# EAGLE design tempmonitor (EAGLE 7.6.0)
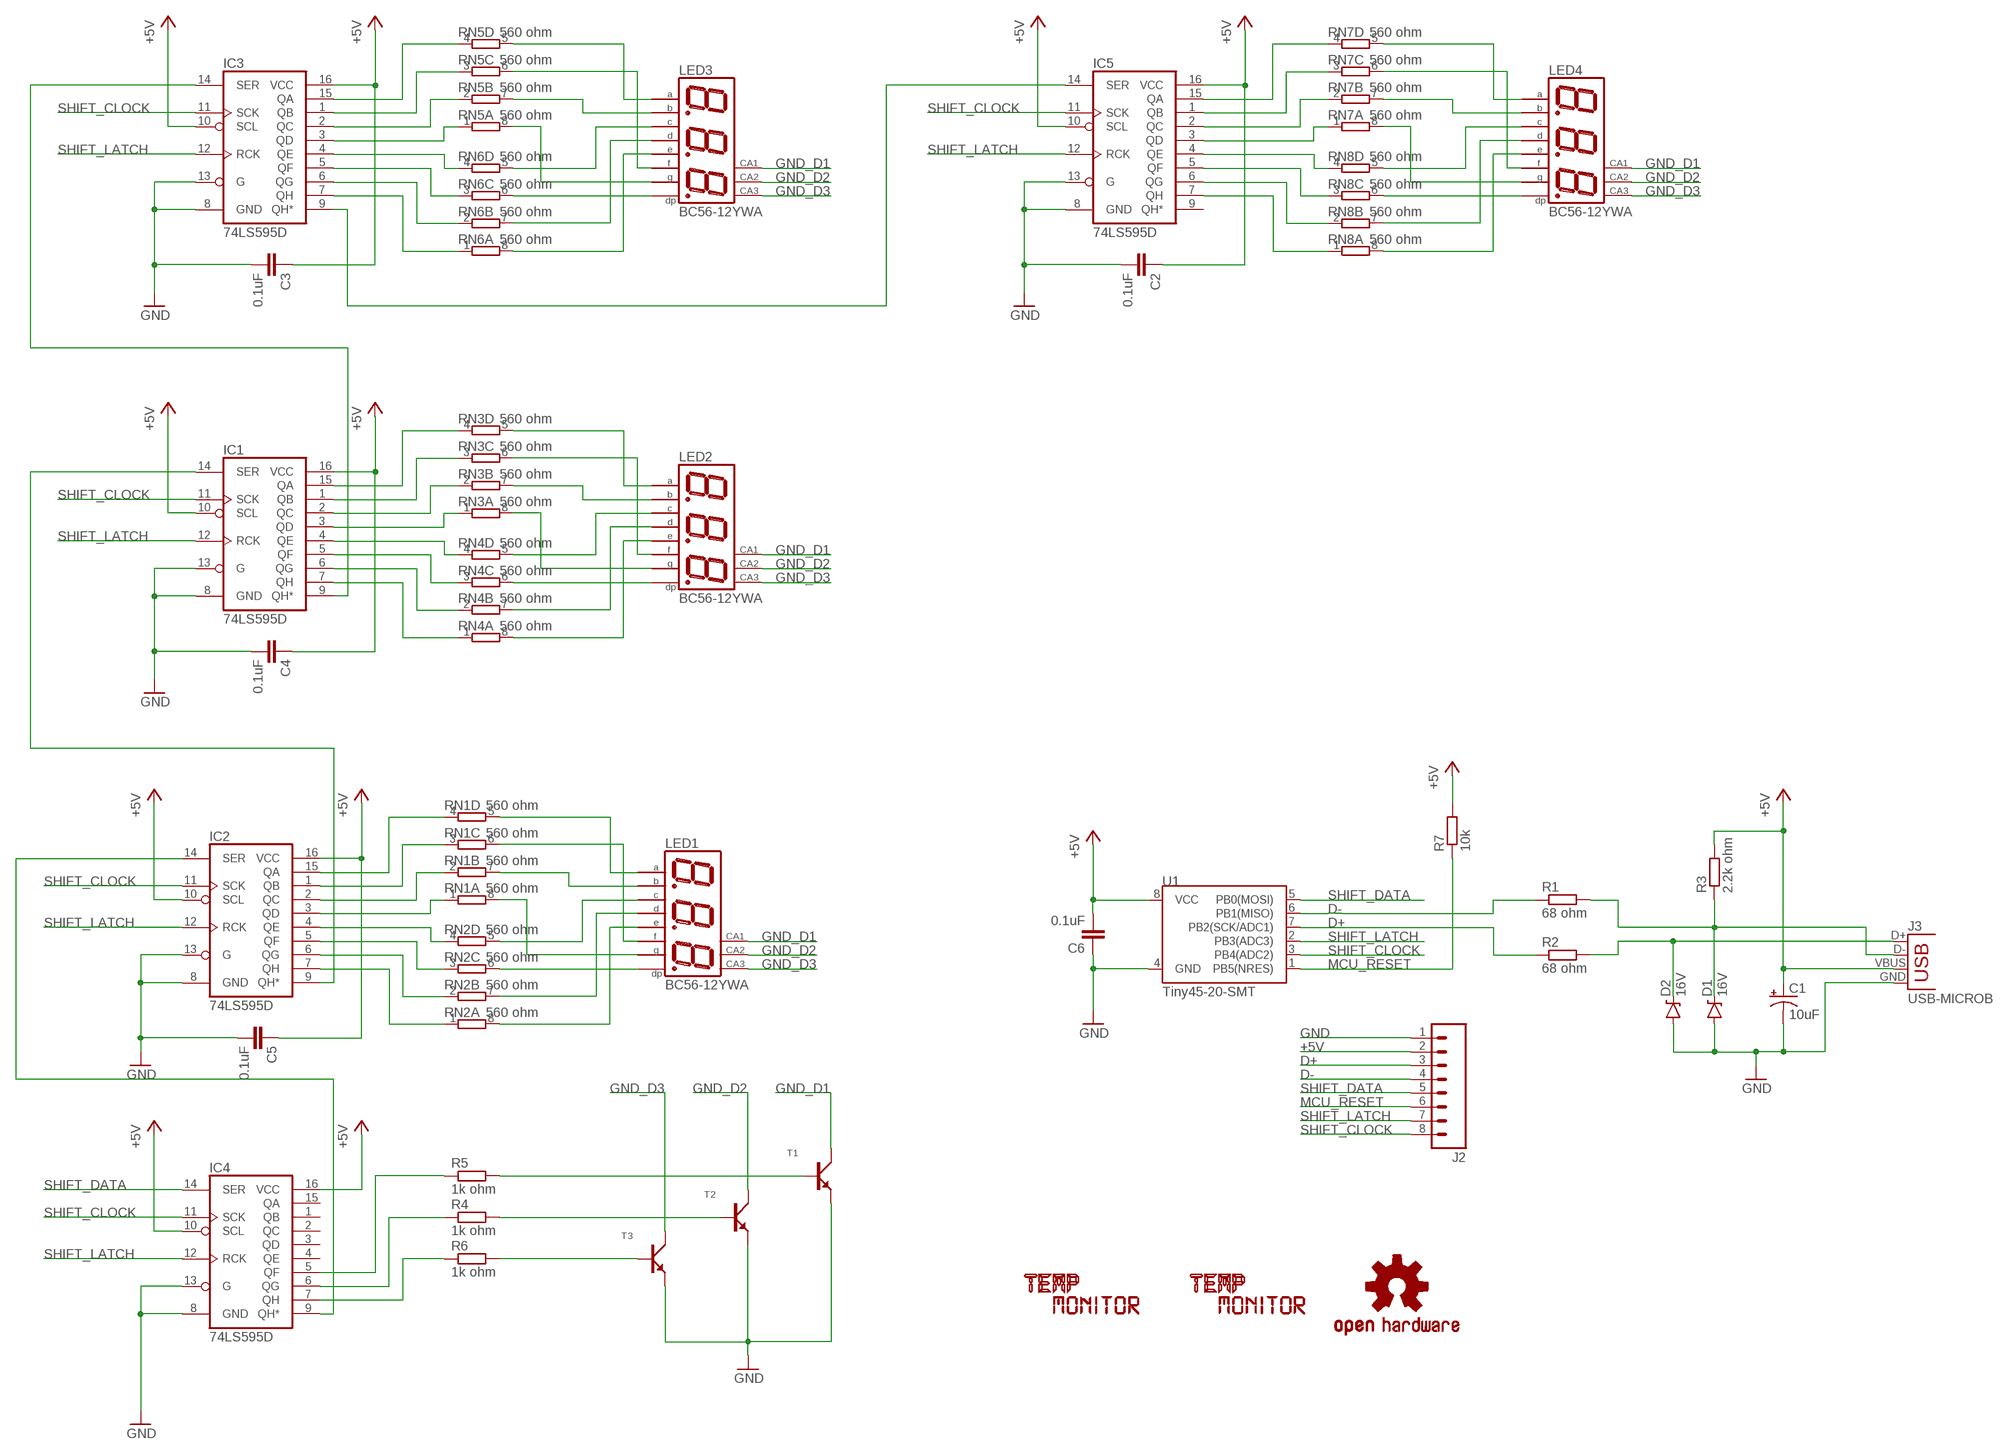
[diagram p0: schematic, sheet 1]

## Parts
C1  10uF  CAP_POLF80  [NIPPON_F80]
C2  0.1uF  C-EUC0805  [C0805]
C3  0.1uF  C-EUC0805  [C0805]
C4  0.1uF  C-EUC0805  [C0805]
C5  0.1uF  C-EUC0805  [C0805]
C6  0.1uF  C-EUC0805  [C0805]
D1  16V  DIODE-ZENER16V  [SOD-123]
D2  16V  DIODE-ZENER16V  [SOD-123]
IC1  74LS595D  [SO16]
IC2  74LS595D  [SO16]
IC3  74LS595D  [SO16]
IC4  74LS595D  [SO16]
IC5  74LS595D  [SO16]
J2  TP_8  [TP_8]
J3  USB-MICROB  [USB-MICROB]
LED1  BC56-12YWA  [BX56-12]
LED2  BC56-12YWA  [BX56-12]
LED3  BC56-12YWA  [BX56-12]
LED4  BC56-12YWA  [BX56-12]
LOGO1  OSHW-LOGOL  [OSHW-LOGO-L]
R1  68 ohm  R-EU_R0805W  [R0805W]
R2  68 ohm  R-EU_R0805W  [R0805W]
R3  2.2k ohm  R-EU_R0805W  [R0805W]
R4  1k ohm  R-EU_R0805W  [R0805W]
R5  1k ohm  R-EU_R0805W  [R0805W]
R6  1k ohm  R-EU_R0805W  [R0805W]
R7  10k  R-EU_R0805W  [R0805W]
RN1  560 ohm  4R-NEXBV8V  [EXBV8V]
RN2  560 ohm  4R-NEXBV8V  [EXBV8V]
RN3  560 ohm  4R-NEXBV8V  [EXBV8V]
RN4  560 ohm  4R-NEXBV8V  [EXBV8V]
RN5  560 ohm  4R-NEXBV8V  [EXBV8V]
RN6  560 ohm  4R-NEXBV8V  [EXBV8V]
RN7  560 ohm  4R-NEXBV8V  [EXBV8V]
RN8  560 ohm  4R-NEXBV8V  [EXBV8V]
T1  NPN  [SOT23]
T2  NPN  [SOT23]
T3  NPN  [SOT23]
U1  Tiny45-20-SMT  ATTINY45TINY45-20-SMT  [SO08-EIAJ]
U$1  LOGO  [LOGO_M]
U$2  LOGO  [LOGO_M]

## Nets
+5V: C1.+ C2.1 C3.1 C4.1 C5.1 C6.2 IC1.10(SCL) IC1.16(VCC) IC2.10(SCL) IC2.16(VCC) IC3.10(SCL) IC3.16(VCC) IC4.10(SCL) IC4.16(VCC) IC5.10(SCL) IC5.16(VCC) J2.2 J3.VBUS R3.2 R7.2 U1.8(VCC)
D+: J2.3 R2.1 U1.7(PB2(SCK/ADC1))
D-: J2.4 R1.1 U1.6(PB1(MISO))
GND: C1.- C2.2 C3.2 C4.2 C5.2 C6.1 D1.A D2.A IC1.8(GND) IC1.13(G) IC2.8(GND) IC2.13(G) IC3.8(GND) IC3.13(G) IC4.8(GND) IC4.13(G) IC5.8(GND) IC5.13(G) J2.1 J3.GND T1.2(E) T2.2(E) T3.2(E) U1.4(GND)
GND_D1: LED1.12(CA) LED2.12(CA) LED3.12(CA) LED4.12(CA) T1.3(C)
GND_D2: LED1.9(CA) LED2.9(CA) LED3.9(CA) LED4.9(CA) T2.3(C)
GND_D3: LED1.8(CA) LED2.8(CA) LED3.8(CA) LED4.8(CA) T3.3(C)
MCU_RESET: J2.6 R7.1 U1.1(PB5(NRES))
N$1: D1.C J3.D- R1.2 R3.1
N$2: D2.C J3.D+ R2.2
N$3: IC2.15(QA) RN1.4
N$4: IC2.1(QB) RN1.3
N$5: IC4.7(QH) R6.1
N$6: IC2.14(SER) IC4.9(QH*)
N$7: IC2.2(QC) RN1.2
N$8: IC2.3(QD) RN1.1
N$9: IC2.4(QE) RN2.4
N$10: IC2.5(QF) RN2.3
N$11: IC2.6(QG) RN2.2
N$12: IC2.7(QH) RN2.1
N$13: LED1.4(C) RN2.5
N$14: LED1.7(B) RN1.7
N$15: LED1.11(A) RN1.5
N$16: LED1.10(F) RN1.6
N$17: LED1.5(G) RN1.8
N$18: LED1.2(D) RN2.7
N$19: LED1.3(DP) RN2.6
N$20: LED1.1(E) RN2.8
N$21: IC1.15(QA) RN3.4
N$22: IC1.1(QB) RN3.3
N$23: IC1.2(QC) RN3.2
N$24: IC1.3(QD) RN3.1
N$25: IC1.4(QE) RN4.4
N$26: IC1.5(QF) RN4.3
N$27: IC1.6(QG) RN4.2
N$28: IC1.7(QH) RN4.1
N$29: LED2.1(E) RN4.8
N$30: LED2.2(D) RN4.7
N$31: LED2.4(C) RN4.5
N$32: IC4.6(QG) R4.1
N$33: IC4.5(QF) R5.1
N$34: IC5.15(QA) RN7.4
N$35: R4.2 T2.1(B)
N$36: R5.2 T1.1(B)
N$37: R6.2 T3.1(B)
N$38: LED2.7(B) RN3.7
N$39: LED2.11(A) RN3.5
N$40: LED2.10(F) RN3.6
N$41: LED2.5(G) RN3.8
N$42: LED2.3(DP) RN4.6
N$43: IC3.15(QA) RN5.4
N$44: IC3.1(QB) RN5.3
N$45: IC3.2(QC) RN5.2
N$46: IC3.3(QD) RN5.1
N$47: IC3.4(QE) RN6.4
N$48: IC3.5(QF) RN6.3
N$49: IC3.6(QG) RN6.2
N$50: IC3.7(QH) RN6.1
N$51: LED3.1(E) RN6.8
N$52: LED3.2(D) RN6.7
N$53: LED3.4(C) RN6.5
N$54: LED3.7(B) RN5.7
N$55: LED3.11(A) RN5.5
N$56: LED3.10(F) RN5.6
N$57: LED3.5(G) RN5.8
N$58: LED3.3(DP) RN6.6
N$59: IC5.1(QB) RN7.3
N$60: IC5.2(QC) RN7.2
N$61: IC5.3(QD) RN7.1
N$62: IC5.4(QE) RN8.4
N$63: IC5.5(QF) RN8.3
N$64: IC5.6(QG) RN8.2
N$65: IC5.7(QH) RN8.1
N$66: LED4.1(E) RN8.8
N$67: LED4.2(D) RN8.7
N$68: LED4.4(C) RN8.5
N$69: LED4.7(B) RN7.7
N$70: LED4.11(A) RN7.5
N$71: LED4.10(F) RN7.6
N$72: LED4.5(G) RN7.8
N$73: LED4.3(DP) RN8.6
N$74: IC3.9(QH*) IC5.14(SER)
N$76: IC1.9(QH*) IC3.14(SER)
N$77: IC1.14(SER) IC2.9(QH*)
SHIFT_CLOCK: IC1.11(SCK) IC2.11(SCK) IC3.11(SCK) IC4.11(SCK) IC5.11(SCK) J2.8 U1.3(PB4(ADC2))
SHIFT_DATA: IC4.14(SER) J2.5 U1.5(PB0(MOSI))
SHIFT_LATCH: IC1.12(RCK) IC2.12(RCK) IC3.12(RCK) IC4.12(RCK) IC5.12(RCK) J2.7 U1.2(PB3(ADC3))
Unconnected: IC4.1(QB) IC4.2(QC) IC4.3(QD) IC4.4(QE) IC4.15(QA) IC5.9(QH*)

## Library data of the parts
C1 = SparkFun-Capacitors:CAP_POL: Capacitor Polarized These are standard SMD and PTH capacitors. Normally 10uF, 47uF, and 100uF in electrolytic and tantalum varieties. Always verify the external diameter of the through hole cap, it varies with capacity, voltage, and manufacturer. The EIA devices should be standard.
C2-C6 = resistor:C-EU: CAPACITOR, European symbol
D1 D2 = SparkFun-DiscreteSemi:DIODE-ZENER: Zener Diode Production Part - 8199 3.4V Zener Voltage; PROD_ID: DIO-12440
IC1-IC5 = SparkFun-DigitalIC:74*595: 8-bit SHIFT REGISTER, output latch; PROD_ID: IC-07875
J2 = TempMonitor:TP_8
J3 = SparkFun-Connectors:USB: USB Connectors USB-B-PTH is fully proven SKU : PRT-00139/CONN-08278 USB-miniB is fully proven SKU : PRT-00587 USB-A-PCB is untested. USB-A-H is throughly reviewed, but untested. Spark Fun Electronics SKU : PRT-00437 USB-B-SMT is throughly reviewed, but untested. Needs silkscreen touching up. USB-A-S has not been used/tested USB-MB-H has not been used/tested USB-MICROB has been used. CONN-09505; PROD_ID: CONN-09505
LED1-LED4 = display-kingbright:B?56-12*WA: 14.22mm (0.56INCH) THREE DIGIT NUMERIC DISPLAY Source: http://www.kingbright.com .. BA56-11EWA(Ver1189474895.pdf; OC_FARNELL: unknown; OC_NEWARK: unknown
LOGO1 = SparkFun-Aesthetics:OSHW-LOGO: Open Source Hardware Logo This logo indicates the piece of hardware it is found on incorporates a OSHW license and/or adheres to the definition of open source hardware found here: http://freedomdefined.org/OSHW
R1-R7 = resistor:R-EU_: RESISTOR, European symbol
RN1-RN8 = resistor-dil:4R-N: Array Chip Resistor Source: RS Component / Phycomp; OC_FARNELL: unknown; OC_NEWARK: unknown
T1-T3 = TempMonitor:NPN
U1 = SparkFun-DigitalIC:ATTINY45: Atmel 8-pin 2/4/8kB flash uC; PROD_ID: IC-08922
U$1 U$2 = TempMonitor:LOGO

## Board
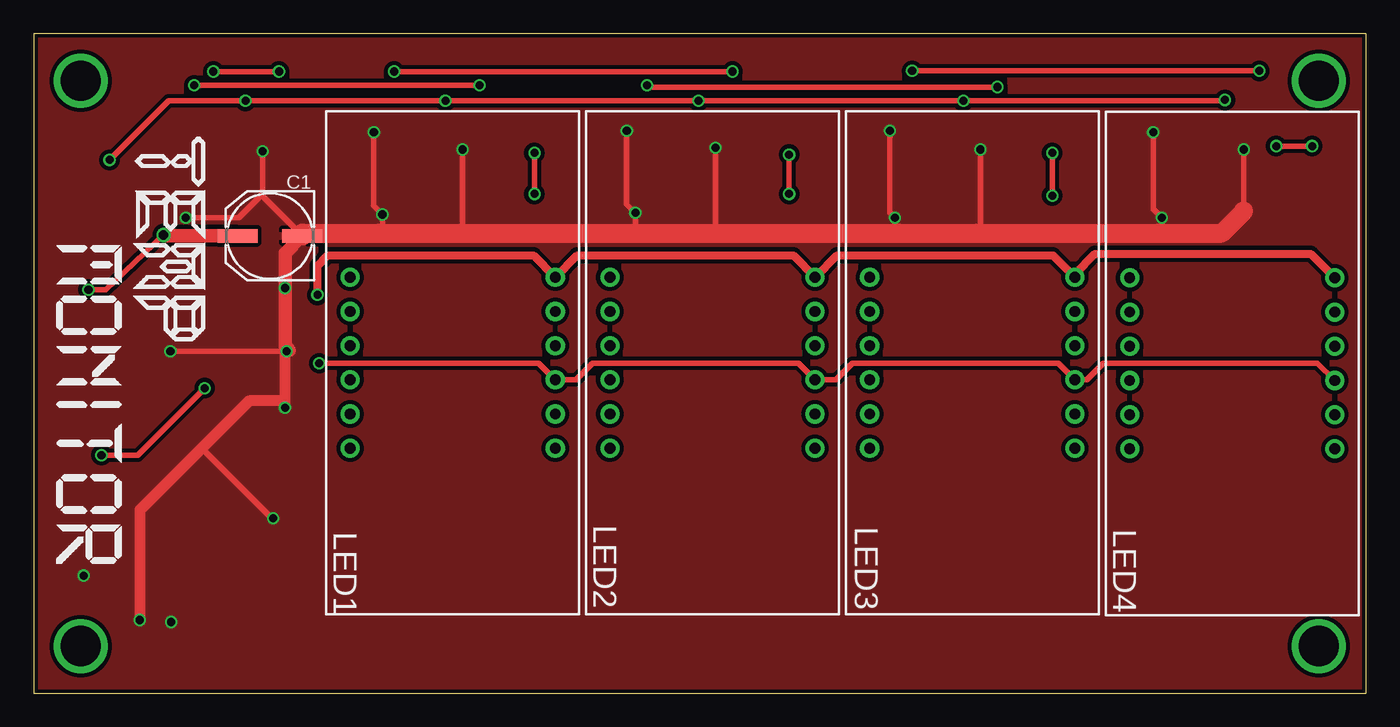
[diagram p1: board, top side]
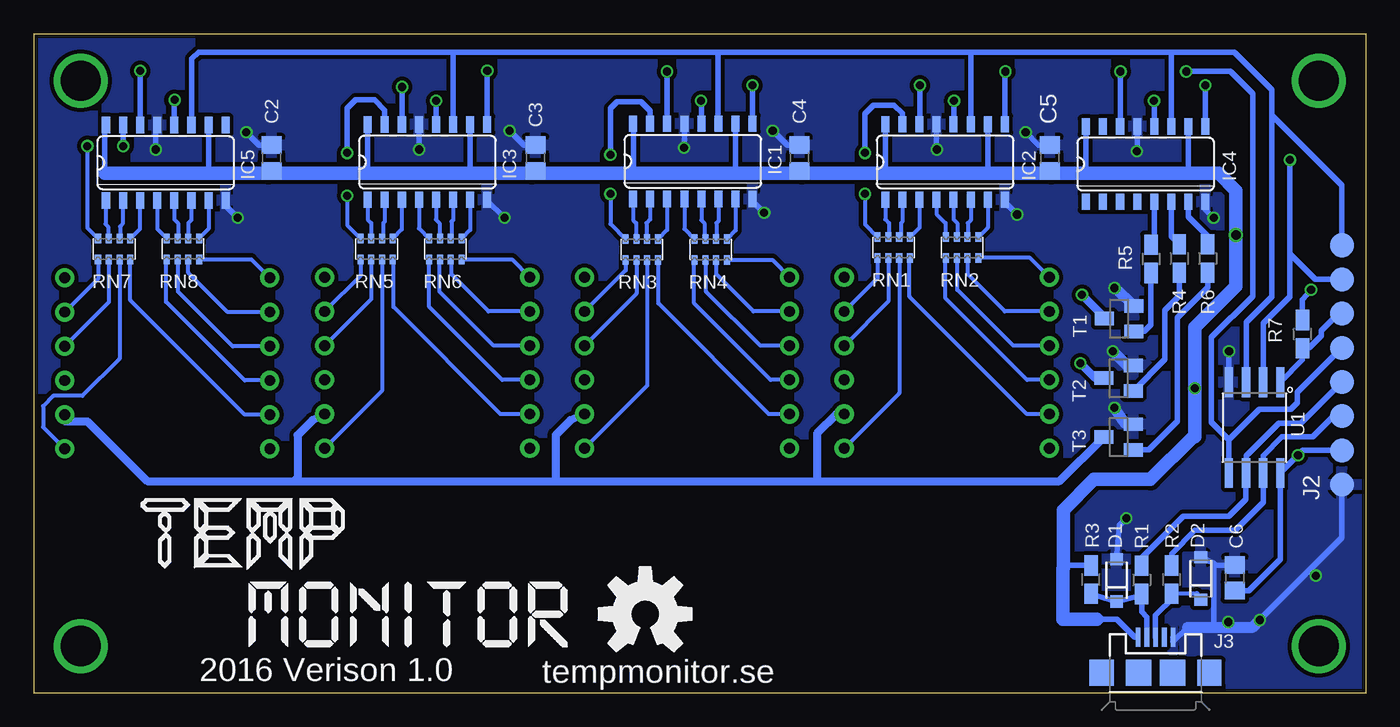
[diagram p2: board, bottom side, seen from below]

Size 99 x 49 mm. Coordinates in mm from the lower left corner, seen from the top.
Outline: 0,0 99,0 99,49 0,49 0,0
Copper layers (1*16): Top 0.035mm / dielectric 1.5mm / Bottom 0.035mm
Design rules "SeeedStudio_2layer_DRU_no_angle_20140221": minimum track width 6mil, minimum drill 12mil, track to track 6mil, track to pad 6mil, pad to pad 6mil, via to via 6mil, smd to smd 0mil, copper to edge 10mil, drill to drill 10mil, minimum pad ring 10mil, minimum via ring 6mil, stop-mask expansion 2mil, vias tented up to drill 100mil, thermal gap 10mil

### Footprints (pad centres in the part's own frame; a part is rotated, then mirrored left to right if it is on the bottom)
NIPPON_F80 = smd 2.95 x 1: + 2.4,0; - -2.4,0
C0805 = smd 1.3 x 1.5: 1 -0.95,0; 2 0.95,0
SOD-123 = smd 0.9 x 0.95: A 1.575,0; C -1.575,0
SO16 = smd 0.6 x 1.2: 1 -4.445,-2.8; 2 -3.175,-2.8; 3 -1.905,-2.8; 4 -0.635,-2.8; 5 0.635,-2.8; 6 1.905,-2.8; 7 3.175,-2.8; 8 4.445,-2.8; 9 4.445,2.8; 10 3.175,2.8; 11 1.905,2.8; 12 0.635,2.8; 13 -0.635,2.8; 14 -1.905,2.8; 15 -3.175,2.8; 16 -4.445,2.8
TP_8 = smd 1.778 x 1.778: 1 0,0; 2 2.54,0; 3 5.08,0; 4 7.62,0; 5 10.16,0; 6 12.7,0; 7 15.24,0; 8 17.78,0
USB-MICROB = smd 0.35 x 1.4: D+ 0,2.65; D- -0.65,2.65; GND 1.3,2.65; ID 0.65,2.65; VBUS -1.3,2.65 | smd 1.8 x 1.9: MT1 -4,0; MT2 4,0 | smd 1.9 x 1.9: P$1 -1.27,0; P$2 1.27,0
BX56-12 = drill 0.8 pad 1.422: 1 -6.35,-7.62; 2 -3.81,-7.62; 3 -1.27,-7.62; 4 1.27,-7.62; 5 3.81,-7.62; 6 6.35,-7.62; 7 6.35,7.62; 8 3.81,7.62; 9 1.27,7.62; 10 -1.27,7.62; 11 -3.81,7.62; 12 -6.35,7.62
R0805W = smd 1.5 x 1: 1 -1.052,0; 2 1.052,0
EXBV8V = smd 0.45 x 0.7: 1 -1.2,-0.775; 2 -0.4,-0.775; 3 0.4,-0.775; 4 1.2,-0.775; 5 1.2,0.775; 6 0.4,0.775; 7 -0.4,0.775; 8 -1.2,0.775
SOT23 = smd 1 x 1.4: 1 -0.95,-1.1; 2 0.95,-1.1; 3 0,1.1
SO08-EIAJ = smd 0.61 x 2.21: 1 -1.905,-3.378; 2 -0.635,-3.378; 3 0.635,-3.378; 4 1.905,-3.378; 5 1.905,3.353; 6 0.635,3.353; 7 -0.635,3.353; 8 -1.905,3.353

### Placement (x,y rotation side)
C1  17.56,33.98 180 top
C2  81.31,39.76 90 bottom
C3  61.71,39.76 90 bottom
C4  42.1,39.76 90 bottom
C5  23.48,39.76 90 bottom
C6  9.74,8.57 270 bottom
D1  18.53,8.39 90 bottom
D2  12.27,8.52 90 bottom
IC1  50.01,39.52 0 bottom
IC2  31.27,39.46 0 bottom
IC3  69.73,39.45 0 bottom
IC4  16.36,39.31 0 bottom
IC5  89.18,39.41 0 bottom
J2  1.79,15.5 90 bottom
J3  15.63,1.52 0 bottom
LED1  31.14,24.55 270 top
LED2  50.45,24.55 270 top
LED3  69.75,24.55 270 top
LED4  89.07,24.51 270 top
LOGO1  53.55,5.88 0 bottom
R1  16.66,8.42 270 bottom
R2  14.45,8.44 270 bottom
R3  20.43,8.44 90 bottom
R4  13.86,32.3 270 bottom
R5  15.97,32.27 270 bottom
R6  11.75,32.3 270 bottom
R7  4.71,26.68 90 bottom
RN1  35.08,33.11 180 bottom
RN2  30,33.11 180 bottom
RN3  53.81,32.96 180 bottom
RN4  48.69,32.96 180 bottom
RN5  73.51,33.01 180 bottom
RN6  68.41,33 180 bottom
RN7  93.02,33.01 180 bottom
RN8  87.91,33.01 180 bottom
T1  18.33,27.82 90 bottom
T2  18.38,23.4 90 bottom
T3  18.38,19.03 90 bottom
U1  8.27,19.72 180 bottom
U$1  1.68,41.31 270 top
U$2  91.04,3.44 0 bottom

### Tracks (layer width: path | path; a pad name or v marks a point on that pad's centre or on a via)
+5V  (via drill 0.6, 0.7)
  Top 0.406: v4.07,29.98 5.34,29.98 v9.66,34.04 | v5.04,17.69 7.73,17.69 v12.71,22.66
  Top 1.016: C1.+ 9.72,33.98 v9.66,34.04
  Bottom 0.406: 74.14,42.25 IC3.16 74.18,38.62 | 35.78,42.26 IC2.16 35.71,38.76 35.57,38.62 | IC1.16 54.42,42.31 54.42,38.68 54.36,38.62 | IC3.10 66.56,38.87 66.3,38.62 | 28.16,42.26 IC2.10 28.09,38.72 28.2,38.62 | 20,5.5 18.5,5.5 17.17,4.17 J3.VBUS | 93.73,38.62 93.73,42.1 IC5.16 | IC5.10 86,39.02 85.61,38.62 | IC1.10 46.84,38.78 47,38.62 | IC4.16 20.8,38.65 20.84,38.62 | IC4.10 13.18,38.65 13.22,38.62 | J2.2 4.69,18.04 U1.8 | R7.2 4.71,29.22 v4.07,29.98 | C2.1 81.54,38.81 81.54,38.62 | C3.1 61.98,38.81 61.98,38.62 | C4.1 41.92,38.81 41.92,38.62 | C5.1 23.38,38.81 23.38,38.62 | C6.2 10.23,7.63 8.7,7.63 6.37,9.96 U1.8 | U1.8 6.36,16.37 v5.04,17.69 | R3.2 22.42,9.49 22.49,9.56
  Bottom 1.016: 93.73,38.62 85.61,38.62 81.54,38.62 74.18,38.62 66.3,38.62 61.98,38.62 54.36,38.62 47,38.62 41.92,38.62 35.57,38.62 28.2,38.62 23.38,38.62 20.84,38.62 13.22,38.62 10.93,38.62 9.66,37.35 v9.66,34.04 9.66,30.23 12.71,27.19 v12.71,22.66 12.71,19.06 12.84,19.06 16.01,15.88 20.2,15.88 22.49,13.6 22.49,9.56 22.49,9.28 22.5,9.27 22.5,5.5 20,5.5
D+
  Bottom 0.406: 14.44,9.5 R2.1 14.44,9.51 14.44,10.37 12.71,12.1 9.71,12.1 7.64,14.17 U1.7 7.63,16.38 7.63,17.66 6.23,19.06 3.94,19.06 2.42,20.58 J2.3
D-
  Bottom 0.406: 16.86,9.67 R1.1 16.62,9.51 16.62,10.12 13.57,13.16 10.17,13.16 8.91,14.43 U1.6 8.9,16.38 8.9,17.66 6.49,20.07 4.83,20.07 J2.4
GND  (via drill 0.6)
  Top 0.406: 89.92,35.82 v89.92,40.39 | v70.37,40.39 70.37,34.44 70.11,34.18 | 64.27,34.18 64.02,34.44 v64.02,35.31 63.63,35.7 v63.63,41.79 | v50.68,40.52 50.68,34.18 | 44.59,34.18 44.71,34.31 v44.71,35.7 44.08,36.33 v44.08,41.79 | v31.89,40.39 31.89,34.31 31.76,34.18 | 25.66,34.18 25.92,34.44 v25.92,35.57 25.28,36.2 v25.28,41.66 | v17.03,40.27 17.03,37.09 | 17.03,37.09 17.03,36.92 C1.- | v11.31,35.31 15.25,35.31 17.03,37.09 | v10.17,25.41 v18.8,25.41 | 83.57,34.18 83.83,34.44 v83.83,35.31 83.19,35.95 v83.19,41.66 | v17.79,13.01 17.69,13.01 12.49,18.21
  Top 0.813: v18.68,21.22 18.68,21.73 | 18.68,21.73 18.68,25.28 v18.8,25.41 | 18.68,21.73 16.01,21.73 12.49,18.21 7.88,13.6 v7.88,5.44
  Top 1.016: C1.- 18.68,32.7 v18.68,30.11 18.68,25.82 19,25.5 18.9,25.5 v18.8,25.41
  Top 1.422: C1.- 19.96,34.18 25.66,34.18 31.76,34.18 44.59,34.18 50.68,34.18 64.27,34.18 70.11,34.18 83.57,34.18 88.29,34.18 89.92,35.82
  Bottom 0.406: IC3.13 70.37,41.92 | 70.37,41.92 | v89.92,40.39 89.92,42.1 IC5.13 | IC5.8 84.73,36.22 v83.83,35.31 | 70.37,41.92 v70.37,40.4 v70.37,40.39 | IC3.8 65.29,36.59 v64.02,35.31 | IC1.13 50.65,40.55 v50.68,40.52 | IC1.8 45.57,36.55 v44.71,35.7 | IC2.13 31.9,40.41 v31.89,40.39 | IC2.8 26.82,36.48 v25.92,35.57 | IC4.13 16.99,40.43 v17.03,40.27 | IC4.8 11.91,35.92 v11.31,35.31 | U1.4 v10.18,25.4 v10.17,25.41 | 81.29,40.71 C2.2 82.24,40.71 v83.19,41.66 | C5.2 24.33,40.71 v25.28,41.66 | C3.2 62.56,40.71 v63.63,41.79 | C4.2 43,40.71 v44.08,41.79 | 13.27,4.88 14.33,3.82 J3.GND | D2.A 11.29,9.67 11.29,9.52 | 11.29,9.52 11.29,4.88 | C6.1 11.29,9.52 | J2.1 1.79,11.54 v7.88,5.44 | D1.A 18.33,12.47 v17.79,13.01
  Bottom 0.813: T1.2 17.23,28.79 v18.68,30.11 | T2.2 17.75,24.35 v18.8,25.41 | T3.2 17.83,19.98 v18.68,21.22 | v7.88,5.44 8.44,4.88 11.29,4.88 13.27,4.88
  other vias: 3.72,8.75 10.23,5.29
  pour Top (isolate 0.305): 0.5,48.5 98.5,48.5 98.5,0.5 0.5,0.5
  pour Bottom (isolate 0.305): 0.5,0.5 98.5,0.5 98.5,48.5 0.5,48.5
GND_D1  (via drill 0.6)
  Top 0.61: v21.09,29.6 21.09,31.76 21.85,32.52 37.15,32.52 LED1.12 38.78,30.91 40.39,32.52 56.45,32.52 LED2.12 58.08,30.91 59.7,32.52 75.75,32.52 LED3.12 77.37,31.14 78.88,32.65 94.9,32.65 LED4.12
  Bottom 0.61: T1.3 19.43,27.94 v21.09,29.6
GND_D2  (via drill 0.6)
  Top 0.406: v21.22,24.52 37.53,24.52 LED1.9 40.3,23.29 41.54,24.52 56.83,24.52 LED2.9 59.61,23.29 60.84,24.52 76.14,24.52 LED3.9 78.28,23.29 79.51,24.52 95.41,24.52 LED4.9
  Bottom 0.61: T2.3 20.1,23.4 v21.22,24.52
GND_D3
  Bottom 0.61: LED4.8 96.65,20.2 95,20.2 90.56,15.76 79.64,15.76 | 79.64,15.76 60.08,15.76 | 60.08,15.76 40.77,15.76 | 40.77,15.76 22.76,15.76 T3.3 | LED2.8 59.1,20.29 60.21,19.18 60.21,15.88 60.08,15.76 | LED3.8 78.28,20.29 79.38,19.18 79.38,16.01 79.64,15.76 | LED1.8 39.34,20.75 40.77,19.31 40.77,15.76
MCU_RESET
  Bottom 0.406: U1.1 4.71,24.76 R7.1 4.67,25.66 4.2,25.66 3.31,26.55 3.31,26.93 2.04,28.2 J2.6
N$1
  Bottom 0.406: R1.2 16.79,7.24 D1.C 19.98,7.24 R3.1 | 16.65,7.36 R1.2 | R1.2 16.66,6.04 16.26,5.65 16.26,3.82 J3.D-
N$2
  Bottom 0.305: 12.55,7.39 R2.2
  Bottom 0.406: 14.49,7.35 R2.2 14.23,7.17 15.63,5.78 J3.D+ | D2.C 12.55,7.39
N$3  (via drill 0.6)
  Top 0.406: v37.22,40.14 v37.22,37.09
  Bottom 0.305: v37.22,37.09 37.22,34.83 RN1.4
  Bottom 0.406: IC2.15 34.44,43.08 35.06,43.7 36.58,43.7 37.22,43.06 v37.22,40.14
N$4
  Bottom 0.305: IC2.1 35.71,35.21 35.43,34.92 35.43,33.94 RN1.3
N$5
  Bottom 0.406: IC4.7 13.18,35.4 11.73,33.95 11.73,33.38 R6.1
N$6  (via drill 0.6)
  Top 0.406: v11.93,45.16 v33.14,45.16
  Bottom 0.406: IC4.9 11.91,45.16 v11.93,45.16 | v33.14,45.16 33.14,42.26 IC2.14
N$7
  Bottom 0.305: IC2.2 34.44,35.02 34.54,34.92 34.54,34.02 RN1.2
N$8
  Bottom 0.305: IC2.3 33.17,34.59 RN1.1
N$9
  Bottom 0.305: IC2.4 31.9,35.59 31.24,34.92 31.24,33.93 RN2.4
N$10
  Bottom 0.305: IC2.5 30.63,35.21 30.35,34.92 30.35,33.94 RN2.3
N$11
  Bottom 0.305: IC2.6 29.36,35.15 29.59,34.92 RN2.2
N$12
  Bottom 0.305: IC2.7 28.09,34.59 RN2.1
N$13
  Bottom 0.305: LED1.4 25.19,23.29 31.24,29.34 31.24,32.3 RN2.5
N$14
  Bottom 0.305: RN1.7 34.68,22.29 LED1.7
N$15
  Bottom 0.305: RN1.5 36.28,30.85 LED1.11
N$16
  Bottom 0.305: RN1.6 35.48,29.11 LED1.10
N$17
  Bottom 0.305: LED1.5 25.19,20.75 33.91,29.46 33.91,32.31 RN1.8
N$18
  Bottom 0.305: LED1.2 26.84,28.36 29.59,31.11 RN2.7
N$19
  Bottom 0.305: LED1.3 26.21,25.82 30.35,29.97 30.35,32.29 RN2.6
N$20
  Bottom 0.305: LED1.1 24.96,32.34 RN2.8
N$21  (via drill 0.6)
  Top 0.406: v56.14,40.01 v56.14,37.09
  Bottom 0.305: v56.14,37.09 56.14,34.87 RN3.4
  Bottom 0.406: IC1.15 53.19,43.28 53.86,43.95 55.63,43.95 56.14,43.44 v56.14,40.01
N$22
  Bottom 0.305: IC1.1 54.46,35.15 54.23,34.92 54.23,33.76 RN3.3
N$23
  Bottom 0.305: IC1.2 53.19,35.2 53.47,34.92 53.47,33.8 RN3.2
N$24
  Bottom 0.305: IC1.3 51.92,34.43 RN3.1
N$25
  Bottom 0.305: IC1.4 50.65,34.5 RN4.4
N$26
  Bottom 0.305: IC1.5 49.38,35.15 49.15,34.92 49.15,33.8 RN4.3
N$27
  Bottom 0.305: IC1.6 48.11,35.08 48.26,34.92 48.26,33.77 RN4.2
N$28
  Bottom 0.305: IC1.7 46.84,34.39 RN4.1
N$29
  Bottom 0.305: RN4.8 44.11,32.19 LED2.1
N$30
  Bottom 0.305: LED2.2 45.51,28.36 48.26,31.11 48.26,32.16 RN4.7
N$31
  Bottom 0.305: LED2.4 44.24,23.29 49.91,28.96 49.91,32.16 RN4.5
N$32
  Bottom 0.406: IC4.6 14.45,33.94 R4.1
N$33
  Bottom 0.406: IC4.5 15.72,33.57 R5.1
N$34  (via drill 0.6)
  Top 0.406: v92.34,40.65 v95,40.65
  Bottom 0.305: v95,40.65 95,34.57 RN7.4
  Bottom 0.406: IC5.15 92.36,40.65 v92.34,40.65
N$35
  Bottom 0.406: 17.27,22.44 T2.1 14.94,24.8 14.94,28.46 13.86,29.54 R4.2
N$36
  Bottom 0.406: R5.2 15.97,27.39 16.48,26.88 17.22,26.88 T1.1
N$37
  Bottom 0.406: T3.1 17.27,18.09 16.12,18.09 14,20.22 14,27.9 11.75,30.15 R6.2
N$38
  Bottom 0.305: RN3.7 53.41,22.86 LED2.7
N$39
  Bottom 0.305: RN3.5 55.01,31.42 LED2.11
N$40
  Bottom 0.305: RN3.6 54.21,29.68 LED2.10
N$41
  Bottom 0.305: LED2.5 44.37,20.75 52.58,28.96 52.58,32.16 RN3.8
N$42
  Bottom 0.305: LED2.3 45,25.82 49.02,29.84 49.02,32.12 RN4.6
N$43  (via drill 0.6)
  Top 0.406: v75.7,40.14 v75.7,36.97
  Bottom 0.305: v75.7,36.97 75.7,34.77 RN5.4
  Bottom 0.406: IC3.15 72.91,43.32 73.67,44.08 75.06,44.08 75.7,43.44 v75.7,40.14
N$44
  Bottom 0.305: IC3.1 74.18,35.19 73.91,34.92 RN5.3
N$45
  Bottom 0.305: IC3.2 72.91,35.04 73.03,34.92 73.03,33.87 RN5.2
N$46
  Bottom 0.305: IC3.3 71.64,34.45 RN5.1
N$47
  Bottom 0.305: IC3.4 70.37,34.53 RN6.4
N$48
  Bottom 0.305: IC3.5 69.1,35.19 68.83,34.92 68.83,33.8 RN6.3
N$49
  Bottom 0.305: IC3.6 67.83,35.17 67.94,35.05 67.94,33.84 RN6.2
N$50
  Bottom 0.305: IC3.7 66.56,34.43 RN6.1
N$51
  Bottom 0.305: RN6.8 63.45,32.22 LED3.1
N$52
  Bottom 0.305: LED3.2 65.19,28.36 67.94,31.11 67.94,32.16 RN6.7
N$53
  Bottom 0.305: LED3.4 64.18,23.29 69.6,28.7 69.6,32.21 RN6.5
N$54
  Bottom 0.305: RN5.7 73.11,22.47 LED3.7
N$55
  Bottom 0.305: RN5.5 74.71,31.03 LED3.11
N$56
  Bottom 0.305: RN5.6 73.91,29.29 LED3.10
N$57
  Bottom 0.305: LED3.5 64.31,20.75 72.26,28.7 72.26,32.19 RN5.8
N$58
  Bottom 0.305: LED3.3 64.81,25.82 68.83,29.84 68.83,32.2 RN6.6
N$59
  Bottom 0.305: 93.66,36.61 93.66,34.85 93.47,34.67 93.47,33.83 RN7.3
  Bottom 0.406: IC5.1 93.66,36.61
N$60
  Bottom 0.305: 92.39,36.61 92.39,34.87 92.58,34.67 92.58,33.82 RN7.2
  Bottom 0.406: IC5.2 92.39,36.61
N$61
  Bottom 0.305: 91.11,36.61 91.11,34.49 RN7.1
  Bottom 0.406: IC5.3 91.11,36.61
N$62
  Bottom 0.305: IC5.4 89.81,34.49 RN8.4
N$63
  Bottom 0.305: IC5.5 88.55,35.2 88.27,34.92 88.27,33.83 RN8.3
N$64
  Bottom 0.305: IC5.6 87.28,35.15 87.5,34.92 RN8.2
N$65
  Bottom 0.305: IC5.7 86,34.49 RN8.1
N$66
  Bottom 0.305: RN8.8 82.83,32.24 LED4.1
N$67
  Bottom 0.305: LED4.2 84.58,28.32 87.5,31.24 RN8.7
N$68
  Bottom 0.305: LED4.4 83.31,23.24 89.15,29.08 89.15,32.19 RN8.5
N$69
  Bottom 0.305: RN7.7 92.62,24.86 95.38,22.1 97.54,22.1 98.3,21.34 98.3,19.77 LED4.7
N$70
  Bottom 0.305: RN7.5 94.22,30.79 LED4.11
N$71
  Bottom 0.305: RN7.6 93.42,29.05 LED4.10
N$72
  Bottom 0.305: LED4.5 83.31,20.7 91.82,29.21 RN7.8
N$73
  Bottom 0.305: LED4.3 84.2,25.78 88.27,29.84 88.27,32.19 RN8.6
N$74  (via drill 0.6)
  Top 0.406: v91.08,46.24 v65.29,46.24
  Bottom 0.406: IC5.14 v91.08,46.24 | v65.29,46.24 IC3.9
N$76  (via drill 0.6)
  Top 0.406: v45.59,45.16 45.59,45.03 v71.62,45.03
  Bottom 0.406: IC1.9 45.57,45.16 v45.59,45.16 | v71.62,45.03 71.62,42.25 IC3.14
N$77  (via drill 0.6)
  Top 0.406: v26.79,46.19 v51.94,46.19
  Bottom 0.406: IC2.9 26.82,46.19 v26.79,46.19 | v51.94,46.19 51.94,42.31 IC1.14
N$78  (via drill 3)
  other vias: 3.5,45.5
N$79  (via drill 3)
  other vias: 95.5,45.5
N$80  (via drill 3)
  other vias: 95.5,3.5
N$81  (via drill 3)
  other vias: 3.5,3.5
SHIFT_CLOCK
  Bottom 0.406: 67.83,47.63 48.14,47.63 | 48.14,47.63 29.34,47.63 | 29.34,47.63 14.49,47.63 arc90 14.45,47.6 | 14.45,47.6 IC4.11 | IC2.11 arc-90 29.34,42.28 29.34,47.63 | IC1.11 arc90 48.14,42.35 48.14,47.63 | IC3.11 arc-90 IC3.11 67.83,47.63 | U1.3 8.9,23.1 8.9,27.57 6.99,29.47 6.99,42.93 | 6.99,42.93 6.99,44.84 9.79,47.63 14.42,47.63 14.45,47.6 | 1.41,33.03 1.66,33.28 J2.8 1.79,37.73 6.99,42.93 | 67.83,47.63 86.75,47.63 87.26,47.12 87.26,42.23 IC5.11
SHIFT_DATA  (via drill 0.6)
  Top 0.406: v13.35,46.19 v18.23,46.19
  Bottom 0.406: 18.29,42.11 IC4.14 18.23,42.14 v18.23,46.19 | v13.35,46.19 13.33,46.21 10.08,46.21 8.4,44.53 8.4,29.5 11.47,26.43 11.47,20.13 10.18,18.84 | U1.5 10.18,18.84 | J2.5 5.09,22.36 5.09,21.6 5.6,21.09 7.92,21.09 10.18,18.84
SHIFT_LATCH  (via drill 0.6)
  Top 0.406: v15.74,44.01 v30.6,44.01 v49.4,44.01 v69.08,44.01 88.53,44.01 v88.53,44.08 | 15.72,43.99 v15.74,44.01 | v15.73,44.02 v15.74,44.01 | v5.64,39.62 10.03,44.01 v15.74,44.01
  Bottom 0.406: IC4.12 15.72,44.01 v15.74,44.01 | v30.6,44.01 30.6,42.26 IC2.12 | IC1.12 49.38,44.01 v49.4,44.01 | IC3.12 69.1,44.01 v69.08,44.01 | U1.2 7.64,27.48 5.67,29.45 5.67,32.65 | 5.67,32.65 5.67,39.59 v5.64,39.62 | IC5.12 88.55,44.08 v88.53,44.08 | J2.7 3.77,30.74 5.67,32.65

### Text on the board
bPlace: tempmonitor.se | 2016 Verison 1.0